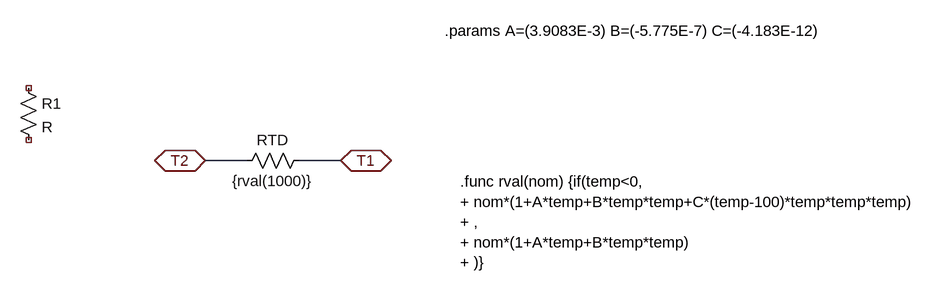
[diagram p0: schematic rtd_PT1206M1B1K00P100.asc]
rtd_PT1206M1B1K00P100.asc, the LTspice schematic file:
Version 4
SHEET 1 1360 680
WIRE 208 112 144 112
WIRE 352 112 288 112
FLAG 352 112 T1
IOPIN 352 112 BiDir
FLAG 144 112 T2
IOPIN 144 112 BiDir
SYMBOL res 304 96 R90
WINDOW 0 0 56 VBottom 2
WINDOW 3 32 56 VTop 2
SYMATTR InstName RTD
SYMATTR Value {rval(1000)}
SYMBOL res -144 -16 R0
SYMATTR InstName R1
TEXT 512 -88 Left 2 !.params A=(3.9083E-3) B=(-5.775E-7) C=(-4.183E-12)
TEXT 536 144 Left 2 !.func rval(nom) {if(temp<0,\n+ nom*(1+A*temp+B*temp*temp+C*(temp-100)*temp*temp*temp)\n+ ,\n+ nom*(1+A*temp+B*temp*temp)\n+ )}

The netlist it stands for:
* rtd_PT1206M1B1K00P100.asc
RTD T1 T2 {rval(1000)}
R1 NC_01 NC_02 R
.params A=(3.9083E-3) B=(-5.775E-7) C=(-4.183E-12)
.func rval(nom) {if(temp<0,
+ nom*(1+A*temp+B*temp*temp+C*(temp-100)*temp*temp*temp)
+ ,
+ nom*(1+A*temp+B*temp*temp)
+ )}
.backanno
.end